# Altium schematic sheet 3V3_LDO.SchDoc
size A; SheetNumber: 2; SheetTotal: 5
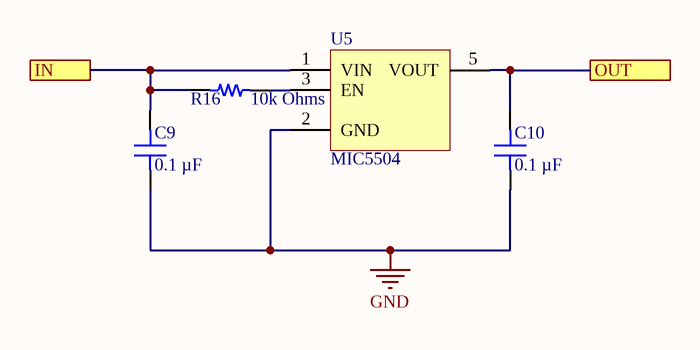
[diagram p0: 3V3_LDO.SchDoc]

## Parts
C9  0.1 µF  [CAP 0402_1005]
C10  0.1 µF  [CAP 0402_1005]
R16  10k Ohms  [RES 0402_1005]
U5  MIC5504  [TI SOT-23-5 DBV]

## Ports
IN, OUT

## Nets
GND: C9.1 C10.1 U5.2(GND)
IN: C9.2 R16.2 U5.1(VIN) ; port IN
OUT: C10.2 U5.5(VOUT) ; port OUT
NetR16_1: R16.1 U5.3(EN)

## Library data of the parts
C9 C10 = C0402C104K4RACAUTO: CAP CER 0.1UF 16V X7R 0402; manufacturer: KEMET; Tolerance: ±10%; Part Number: C0402C104K4RACAUTO; Value: 0.1 µF; Applications: Automotive, Bypass, Decoupling; Capacitance: 0.1 µF; componentlink1description: Datasheet; componentlink1url: https://api.kemet.com/component-edge/download/specsheet/C0402C104K4RACAUTO.pdf; componentlink2description: DigiKey Link; componentlink2url: https://www.digikey.com/en/products/detail/kemet/C0402C104K4RACAUTO/3314827; Device Package: 0402 (1005 Metric); lastupdated: 8/14/2022 9:05:51 PM; Lifecycle Status: Active; Minimum Order: 1; Mounting Type: Surface Mount, MLCC; Operating Temperature: -55°C ~ 125°C; Package / Case: 0402 (1005 Metric); packaging: TapeAndReel; partid: 3024; Part Status: Active; price: 0.01; Ratings: AEC-Q200; series: SMD Auto X7R; Size / Dimension: 0.039" L x 0.020" W (1.00mm x 0.50mm); Supplier 1: DigiKey; Supplier Part Number 1: 399-6828-1-ND; Temperature Coefficient: X7R; Thickness (Max): 0.022" (0.55mm); Voltage - Rated: 16V
R16 = CRCW0402330RJNEDC: RES 330 OHM 5% 1/16W 0402; Manufacturer: Vishay Dale; Power (Watts): 0.063W, 1/16W; Resistance: 330 Ohms; Temperature Coefficient: ±200ppm/°C; Part Number: CRCW0402330RJNEDC; Value: 10k Ohms; ComponentLink1Description: Datasheet; ComponentLink1URL: http://www.vishay.com/docs/28773/crcwce3.pdf; ComponentLink2Description: DigiKey Link; ComponentLink2URL: https://www.digikey.com/en/products/detail/vishay-dale/CRCW0402330RJNEDC/7928545; Composition: Thick Film; Device Package: 0402 (1005 Metric); Height - Seated (Max): 0.014" (0.35mm); LastUpdated: 8/14/2022 9:23:31 PM; Lifecycle Status: Active; Minimum Order: 1; Number of Terminations: 2; Operating Temperature: -55°C ~ 155°C; Package / Case: 0402 (1005 Metric); Packaging: CutTape; PartId: 15989; Part Status: Active; Price: 0.01; Series: CRCW-C; Size / Dimension: 0.039" L x 0.020" W (1.00mm x 0.50mm); Supplier 1: DigiKey; Supplier Part Number 1: 541-4123-1-ND; Supplier Device Package: 0402; Tolerance: ±5%
U5 = MIC5504-3.3YM5: 3.3V LDO